# Altium project YAOJI.PRJPCB
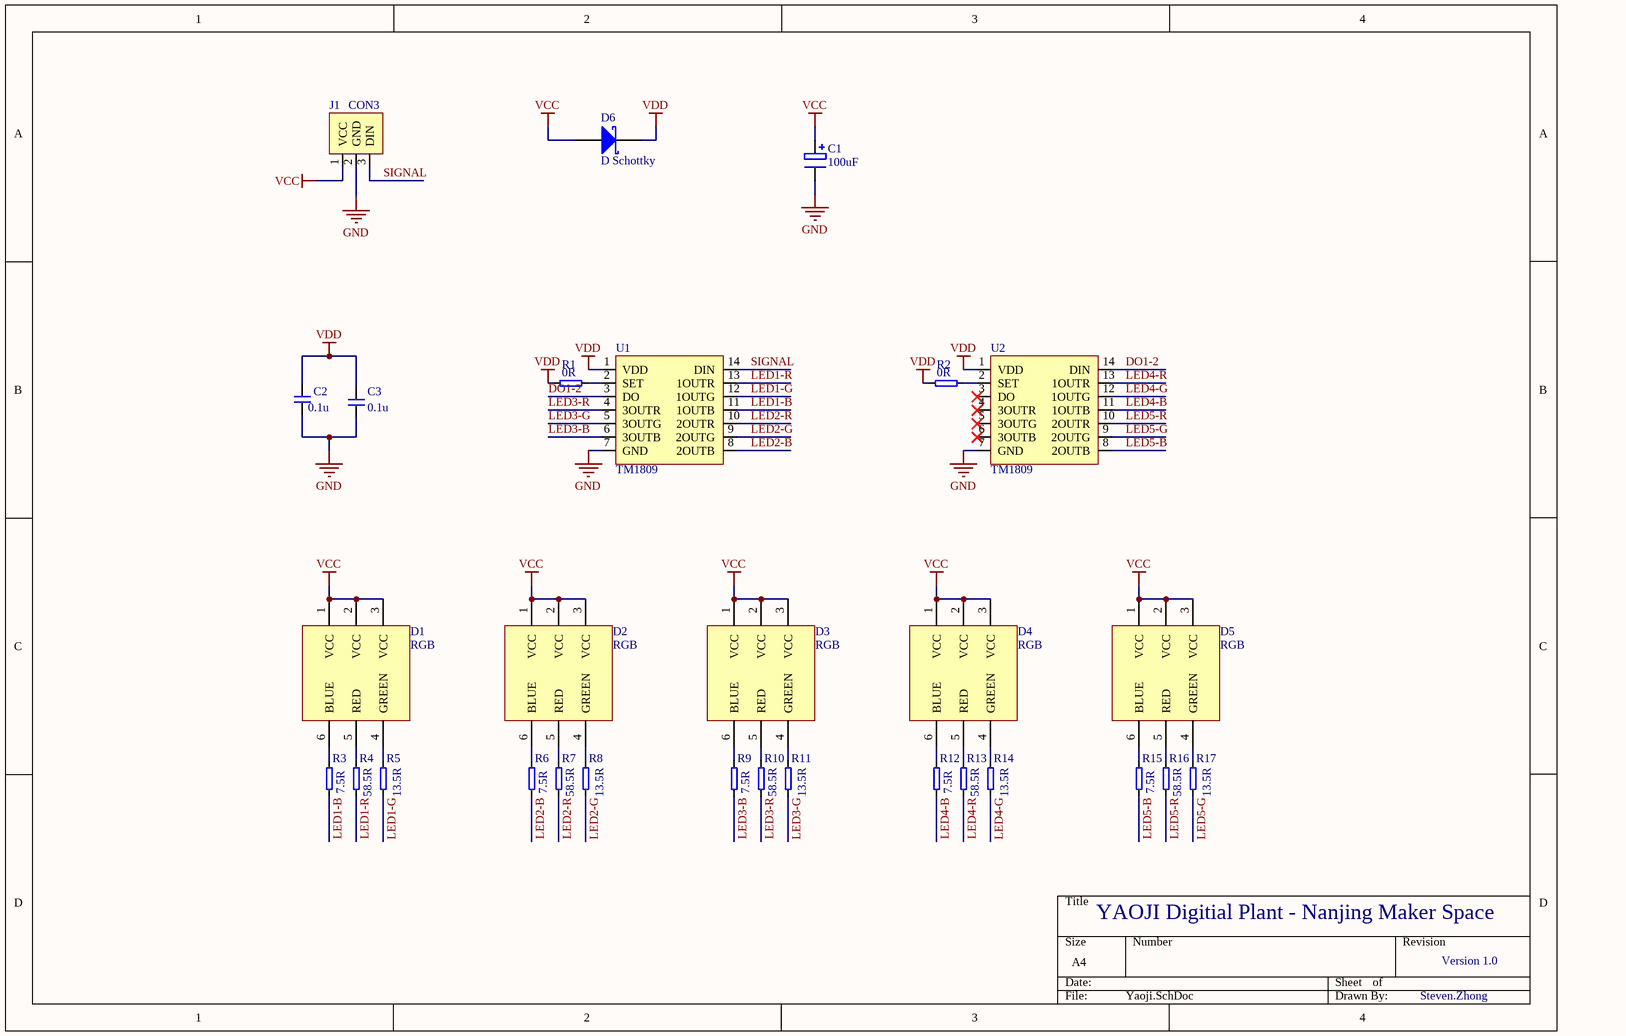
[diagram p0: Yaoji.SchDoc]
1 sheet, 29 parts. Net scope: global (net labels, ports and power ports of the same name join across sheets).
Board file: Yaoji.PcbDoc

## Sheet Yaoji.SchDoc
size A4

### Parts
C1  value 100uF  [CAP_TA3216-18N]  (hidden comment: Cap2)
C2  0.1u  [0603]
C3  0.1u  [0603]
D1  RGB  [5050RGB]
D2  RGB  [5050RGB]
D3  RGB  [5050RGB]
D4  RGB  [5050RGB]
D5  RGB  [5050RGB]
D6  D Schottky  [SMB-DIODE]
J1  CON3  [CON3]
R1  0R  [0603]
R2  0R  [0603]
R3  7.5R  [0603]
R4  58.5R  [0603]
R5  13.5R  [0603]
R6  7.5R  [0603]
R7  58.5R  [0603]
R8  13.5R  [0603]
R9  7.5R  [0603]
R10  58.5R  [0603]
R11  13.5R  [0603]
R12  7.5R  [0603]
R13  58.5R  [0603]
R14  13.5R  [0603]
R15  7.5R  [0603]
R16  58.5R  [0603]
R17  13.5R  [0603]
U1  TM1809  [SO-14]
U2  TM1809  [SO-14]

### Nets
GND: C1.2 C2.1 C3.1 J1.2(GND) U1.7(GND) U2.7(GND)
VCC: C1.1 D1.1(VCC) D1.2(VCC) D1.3(VCC) D2.1(VCC) D2.2(VCC) D2.3(VCC) D3.1(VCC) D3.2(VCC) D3.3(VCC) D4.1(VCC) D4.2(VCC) D4.3(VCC) D5.1(VCC) D5.2(VCC) D5.3(VCC) D6.1(A) J1.1(VCC)
VDD: C2.2 C3.2 D6.2(K) R1.1 R2.1 U1.1(VDD) U2.1(VDD)
DO1-2: U1.3(DO) U2.14(DIN)
LED1-B: R3.1 U1.11(1OUTB)
LED1-G: R5.2 U1.12(1OUTG)
LED1-R: R4.2 U1.13(1OUTR)
LED2-B: R6.1 U1.8(2OUTB)
LED2-G: R8.2 U1.9(2OUTG)
LED2-R: R7.2 U1.10(2OUTR)
LED3-B: R9.1 U1.6(3OUTB)
LED3-G: R11.2 U1.5(3OUTG)
LED3-R: R10.2 U1.4(3OUTR)
LED4-B: R12.1 U2.11(1OUTB)
LED4-G: R14.2 U2.12(1OUTG)
LED4-R: R13.2 U2.13(1OUTR)
LED5-B: R15.1 U2.8(2OUTB)
LED5-G: R17.2 U2.9(2OUTG)
LED5-R: R16.2 U2.10(2OUTR)
SIGNAL: J1.3(DIN) U1.14(DIN)
NetD1_4: D1.4(GREEN) R5.1
NetD1_5: D1.5(RED) R4.1
NetD1_6: D1.6(BLUE) R3.2
NetD2_4: D2.4(GREEN) R8.1
NetD2_5: D2.5(RED) R7.1
NetD2_6: D2.6(BLUE) R6.2
NetD3_4: D3.4(GREEN) R11.1
NetD3_5: D3.5(RED) R10.1
NetD3_6: D3.6(BLUE) R9.2
NetD4_4: D4.4(GREEN) R14.1
NetD4_5: D4.5(RED) R13.1
NetD4_6: D4.6(BLUE) R12.2
NetD5_4: D5.4(GREEN) R17.1
NetD5_5: D5.5(RED) R16.1
NetD5_6: D5.6(BLUE) R15.2
NetR1_2: R1.2 U1.2(SET)
NetR2_2: R2.2 U2.2(SET)

Not connected (* = marked no-connect by the designer): U2 3(DO)* 4(3OUTR)* 5(3OUTG)* 6(3OUTB)*

### Notes on the sheet
- YAOJI Digitial Plant - Nanjing Maker Space
- Version 1.0
- Steven.Zhong

### Library data of the parts
C1 = Cap2: Capacitor with pole; Published: 23-Sep-2002; PackageReference: CAPR5-4X5; Publisher: Altium Limited
C2 C3 = Cap
D6 = D Schottky: Schottky Diode; Published: 8-Jun-2000; LatestRevisionDate: 17-Jul-2002; LatestRevisionNote: Re-released for DXP Platform.; PackageReference: SMB; Publisher: Altium Limited; Code_JEDEC: DO-214-AA
R1-R17 = Res